# EAGLE design uC_power (EAGLE 9.6.2)
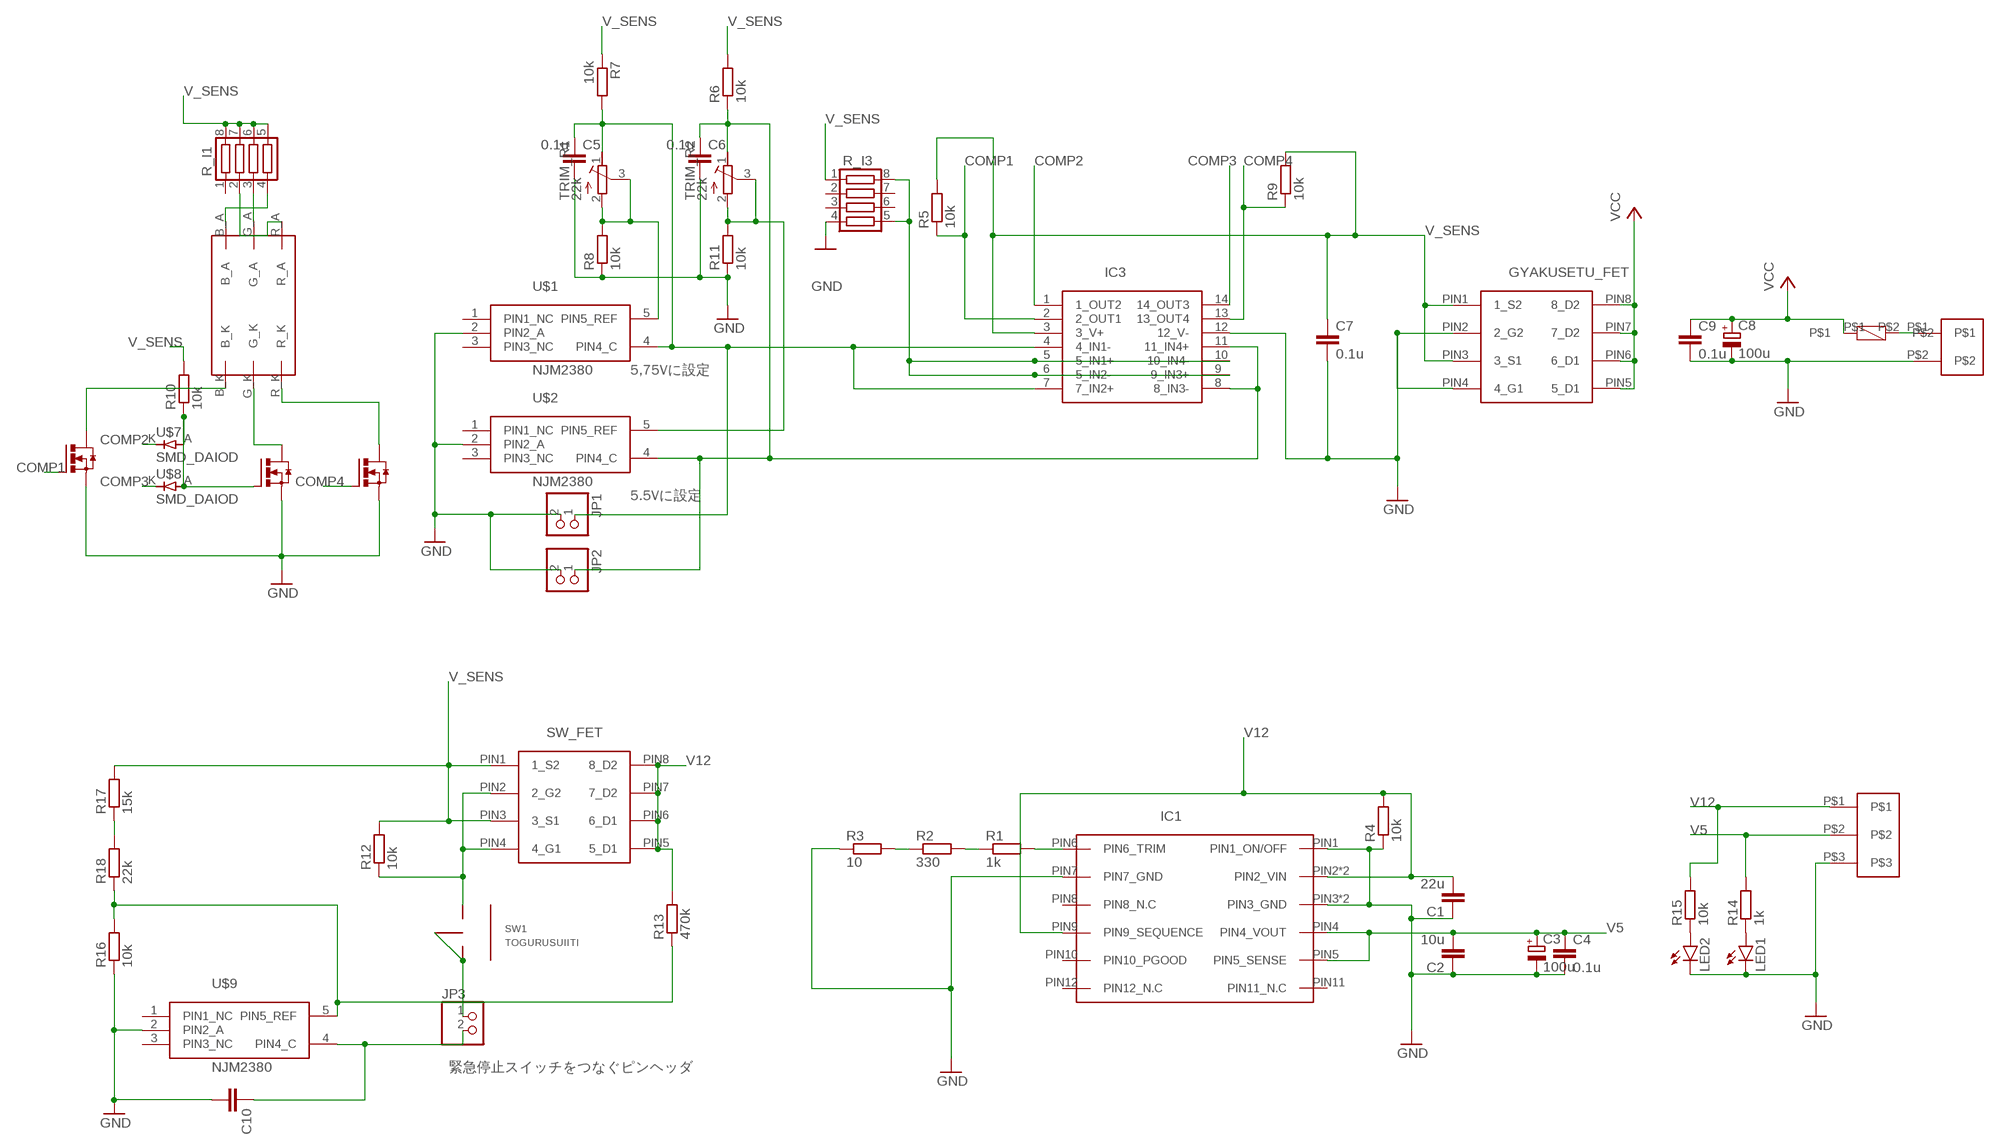
[diagram p0: schematic, sheet 1]

## Parts
C1  22u  C-EUC1608  [C1608]
C2  10u  C-EUC1608  [C1608]
C3  100u  CPOL-EU153CLV-0605  [153CLV-0605]
C4  0.1u  C-EUC1608  [C1608]
C5  0.1u  C-EUC1608  [C1608]
C6  0.1u  C-EUC1608  [C1608]
C7  0.1u  C-EUC1608  [C1608]
C8  100u  CPOL-EU153CLV-0605  [153CLV-0605]
C9  0.1u  C-EUC1608  [C1608]
C10  C-EUC1608  [C1608]
F1  RGEF300  [RGEF300]
GYAKUSETU_FET  FDS4935A  [SOP8]
IC1  MURATA_OKL-T/6-W12N-C  [OKL-T/6-W12N-C]
IC3  UPC339GR  [TSSOP14]
JP1  PINHD-1X2  [1X02]
JP2  PINHD-1X2  [1X02]
JP3  PINHD-1X2  [1X02]
LED1  1608LED  [1608]
LED2  1608LED  [1608]
R1  1k  R_REG  [1608]
R2  330  R_REG  [1608]
R3  10  R_REG  [1608]
R4  10k  R_REG  [1608]
R5  10k  R_REG  [1608]
R6  10k  R_REG  [1608]
R7  10k  R_REG  [1608]
R8  10k  R_REG  [1608]
R9  10k  R_REG  [1608]
R10  10k  R_REG  [1608]
R11  10k  R_REG  [1608]
R12  10k  R_REG  [1608]
R13  470k  R_REG  [1608]
R14  1k  R_REG  [1608]
R15  10k  R_REG  [1608]
R16  10k  R_REG  [1608]
R17  15k  R_REG  [1608]
R18  22k  R_REG  [1608]
R_I1  R_SHUGOU2  [1005X4RESISTOR]
R_I3  R_SHUGOU2  [1005X4RESISTOR]
SW1  TOGURUSUIITI  [TOGURUSUIITI]
SW_FET  FDS4935A  [SOP8]
TRIM_R1  22k  R_TRIM2  [PV23A]
TRIM_R2  22k  R_TRIM2  [PV23A]
U$1  NJM2380  [SOT23-5]
U$2  NJM2380  [SOT23-5]
U$3  SOT23_NFET  [SOT23]
U$4  SOT23_NFET  [SOT23]
U$5  SOT23_NFET  [SOT23]
U$6  RGB_LED  [RGB_LED]
U$7  SMD_DAIOD  [SOD_123]
U$8  SMD_DAIOD  [SOD_123]
U$9  NJM2380  [SOT23-5]
U$10  YUROBLOCK3  [YUROBLOCK3]
U$11  YUROBLOCK2  [YUROBLOCK2]

## Nets
COMP1: IC3.2(2_OUT1) R5.1 U$5.PIN1(PIN1_G)
COMP2: IC3.1(1_OUT2) U$7.K(C)
COMP3: IC3.14(14_OUT3) U$8.K(C)
COMP4: IC3.13(13_OUT4) R9.1 U$3.PIN1(PIN1_G)
G_SW: R10.1 U$4.PIN1(PIN1_G) U$7.A U$8.A
GND: C1.1 C2.1 C3.- C4.2 C5.2 C6.2 C7.2 C8.- C9.2 C10.2 GYAKUSETU_FET.PIN2(2_G2) GYAKUSETU_FET.PIN4(4_G1) IC1.PIN1(PIN1_ON/OFF) IC1.PIN3(PIN3_GND) IC1.PIN3@2(PIN3_GND) IC1.PIN7(PIN7_GND) IC3.12(12_V-) JP1.2 JP2.2 LED1.K LED2.K R3.1 R4.1 R8.1 R11.1 R16.1 R_I3.4 U$1.2(PIN2_A) U$2.2(PIN2_A) U$3.PIN2(PIN3_S) U$4.PIN2(PIN3_S) U$5.PIN2(PIN3_S) U$9.2(PIN2_A) U$10.P$3 U$11.P$2
N$1: R2.1 R3.2
N$2: R1.1 R2.2
N$3: IC1.PIN6(PIN6_TRIM) R1.2
N$4: R12.1 SW1.1 SW_FET.PIN2(2_G2) SW_FET.PIN4(4_G1)
N$5: C5.1 IC3.4(4_IN1-) IC3.7(7_IN2+) JP1.1 R7.2 TRIM_R1.1(E) U$1.4(PIN4_C)
N$6: C10.1 JP3.2 U$9.4(PIN4_C)
N$7: LED1.A R14.1
N$8: R13.1 R16.2 R18.1 U$9.5(PIN5_REF)
N$9: U$3.PIN3(PIN2_D) U$6.R_K
N$10: U$4.PIN3(PIN2_D) U$6.G_K
N$11: U$5.PIN3(PIN2_D) U$6.B_K
N$12: R_I1.4 U$6.B_A
N$13: R_I1.3 U$6.G_A
N$14: R_I1.2 U$6.R_A
N$15: R8.2 TRIM_R1.2(A) TRIM_R1.3(S) U$1.5(PIN5_REF)
N$16: R11.2 TRIM_R2.2(A) TRIM_R2.3(S) U$2.5(PIN5_REF)
N$17: R17.1 R18.2
N$18: LED2.A R15.1
N$19: C6.1 IC3.8(8_IN3-) IC3.11(11_IN4+) JP2.1 R6.1 TRIM_R2.1(E) U$2.4(PIN4_C)
N$20: JP3.1 SW1.2 SW1.C
N$21: F1.P$2 U$11.P$1
N$25: IC3.5(5_IN1+) IC3.6(5_IN2-) IC3.9(9_IN3+) IC3.10(10_IN4-) R_I3.5 R_I3.8
V5: C2.2 C3.+ C4.1 IC1.PIN4(PIN4_VOUT) IC1.PIN5(PIN5_SENSE) R14.2 U$10.P$2
V12: C1.2 IC1.PIN2(PIN2_VIN) IC1.PIN2@2(PIN2_VIN) IC1.PIN9(PIN9_SEQUENCE) R4.2 R13.2 R15.2 SW_FET.PIN5(5_D1) SW_FET.PIN6(6_D1) SW_FET.PIN7(7_D2) SW_FET.PIN8(8_D2) U$10.P$1
V_SENS: C7.1 GYAKUSETU_FET.PIN1(1_S2) GYAKUSETU_FET.PIN3(3_S1) IC3.3(3_V+) R5.2 R6.2 R7.1 R9.2 R10.2 R12.2 R17.2 R_I1.5 R_I1.6 R_I1.7 R_I1.8 R_I3.1 SW_FET.PIN1(1_S2) SW_FET.PIN3(3_S1)
VCC: C8.+ C9.1 F1.P$1 GYAKUSETU_FET.PIN5(5_D1) GYAKUSETU_FET.PIN6(6_D1) GYAKUSETU_FET.PIN7(7_D2) GYAKUSETU_FET.PIN8(8_D2)
Unconnected: IC1.PIN8(PIN8_N.C) IC1.PIN10(PIN10_PGOOD) IC1.PIN11(PIN11_N.C) IC1.PIN12(PIN12_N.C) R_I1.1 R_I3.2 R_I3.3 R_I3.6 R_I3.7 SW1.NC SW1.NC@2(NC) U$1.1(PIN1_NC) U$1.3(PIN3_NC) U$2.1(PIN1_NC) U$2.3(PIN3_NC) U$9.1(PIN1_NC) U$9.3(PIN3_NC)

## Notes on the sheet
- 5,75Vに設定
- 5.5Vに設定
- 緊急停止スイッチをつなぐピンヘッダ

## Library data of the parts
C1 C2 C4-C7 C9 C10 = rcl:C-EU: CAPACITOR, European symbol; SPICEPREFIX: C
C3 C8 = rcl:CPOL-EU: POLARIZED CAPACITOR, European symbol; SPICEPREFIX: C
F1 = user_hyuzu:RGEF300
GYAKUSETU_FET SW_FET = user_tr_fet_igbt:FDS4935A: デュアルPchMOSFET on抵抗19mΩ DS_max電圧-30v GS_max電圧20v 秋月電子通商通販コード[I-01246]
IC1 = user_ic:MURATA_OKL-T/6-W12N-C: ムラタの電源IC 秋月電子通商 M-06187 秋月電子の電源モジュールの中ではカタログスペック最強
IC3 = user_ic:UPC339GR: ルネサスの汎用コンパレータ 単一電源、両電源対応 オープンコレクタ rsコンポーネンツ通販コード[641-6300]
JP1-JP3 = pinhead:PINHD-1X2: PIN HEADER
LED1 LED2 = user_leds:1608LED: 1608LED
R1-R18 = user_rcl:R_REG: 1608パッケージのチップ抵抗 ガッコのリールの抵抗はたぶんこれ
R_I1 R_I3 = user_rcl:R_SHUGOU
SW1 = user_swich:TOGURUSUIITI: 基板用小型3pトグルスイッチ1回路2接点 秋月電子通商通販コード[P-00300]
TRIM_R1 TRIM_R2 = user_rcl:R_TRIM
U$1 U$2 U$9 = user_ic:NJM2380: njm2380af シャントレギュレータ（降伏電圧が可変可能なツナダイオードみたいなもの） ref=2.465(1%) 秋月電子通商[I-14049]
U$3-U$5 = user_tr_fet_igbt:SOT23_NFET
U$6 = user_leds:RGB_LED: 秋月電子通商 I-12726
U$7 U$8 = user_diode:SMD_DAIOD: パッケージはSOD123
U$10 = user_conector:YUROBLOCK3
U$11 = user_conector:YUROBLOCK2: ユーロブロック 秋月電子[P-11599]

## Board
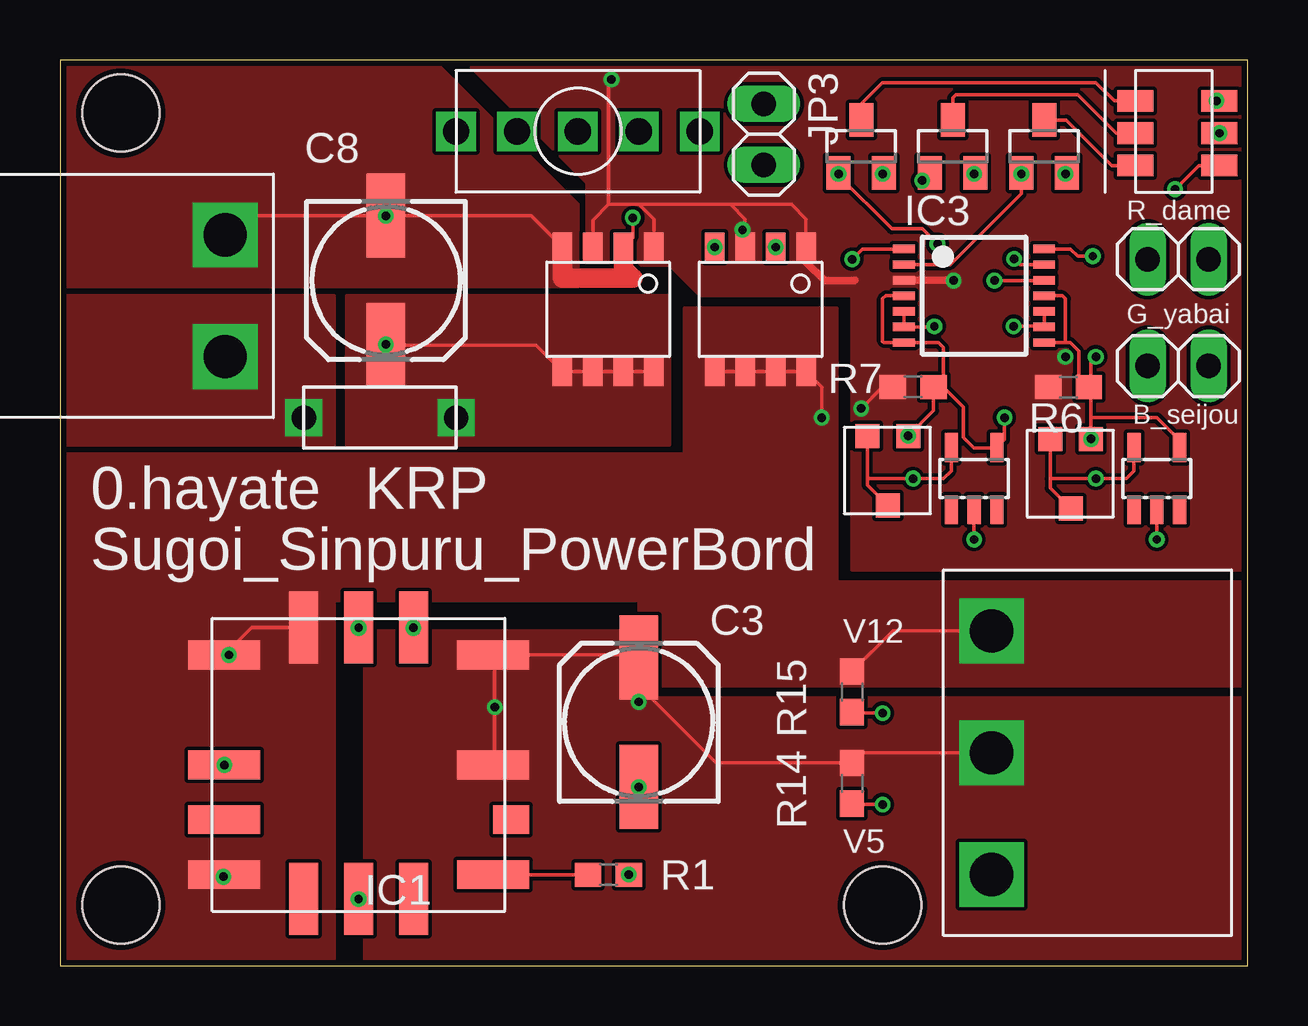
[diagram p1: board, top side]
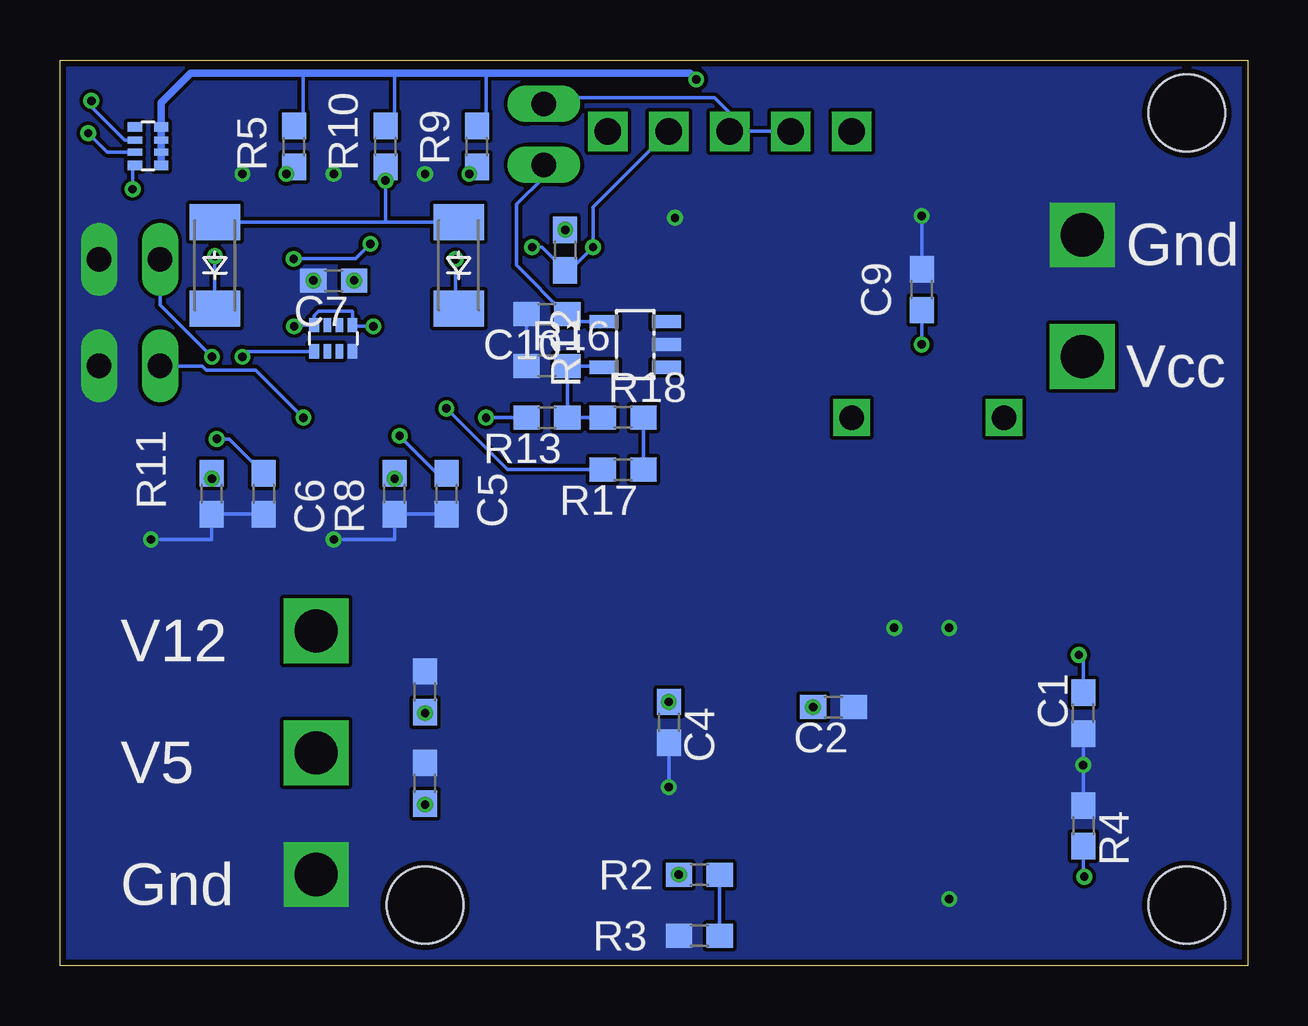
[diagram p2: board, bottom side, seen from below]

Size 49.51 x 37.77 mm. Coordinates in mm from the lower left corner, seen from the top.
Outline: 0,0 49.51,0 49.51,37.77 0,37.77 0,0
Copper layers (1*16): Top 0.035mm / dielectric 1.5mm / Bottom 0.035mm
Design rules "SeeedStudio_2layer_DRU_no_angle_20140221": minimum track width 6mil, minimum drill 12mil, track to track 6mil, track to pad 6mil, pad to pad 6mil, via to via 6mil, smd to smd 0mil, copper to edge 10mil, drill to drill 10mil, minimum pad ring 10mil, minimum via ring 6mil, stop-mask expansion 2mil, vias tented up to drill 100mil, thermal gap 10mil
Holes 3.2 mm at 2.54,2.54 34.29,2.54 2.54,35.56

### Footprints (pad centres in the part's own frame; a part is rotated, then mirrored left to right if it is on the bottom)
C1608 = smd 1.1 x 1: 1 -0.85,0; 2 0.85,0
153CLV-0605 = smd 3.5 x 1.6: + 2.7,0; - -2.7,0
RGEF300 = drill 1.02 square: P$1 0,0; P$2 6.35,0
SOP8 = smd 0.8 x 1.2: PIN1 0.65,-4.57; PIN2 1.92,-4.57; PIN3 3.19,-4.57; PIN4 4.46,-4.57; PIN5 4.46,0.62; PIN6 3.19,0.62; PIN7 1.92,0.62; PIN8 0.65,0.62
OKL-T/6-W12N-C = smd 3 x 1.2: PIN1 -5.85,0.77; PIN2 -5.85,5.35; PIN4 5.35,5.35; PIN5 5.35,0.77; PIN6 5.35,-3.81; PIN9 -5.85,-3.81; PIN10 -5.85,-1.52 | smd 1.2 x 3: PIN2@2 -2.54,6.49; PIN3 -0.25,6.49; PIN3@2 2.04,6.49; PIN7 -0.25,-4.81; PIN8 -2.54,-4.81; PIN12 2.04,-4.81 | smd 1.5 x 1.2: PIN11 6.1,-1.52
TSSOP14 = smd 0.35 x 0.9: 1 -1.95,-2.925; 2 -1.3,-2.925; 3 -0.65,-2.925; 4 0,-2.925; 5 0.65,-2.925; 6 1.3,-2.925; 7 1.95,-2.925; 8 1.95,2.925; 9 1.3,2.925; 10 0.65,2.925; 11 0,2.925; 12 -0.65,2.925; 13 -1.3,2.925; 14 -1.95,2.925
1X02 = drill 1.016 long: 1 -1.27,0; 2 1.27,0
1608 = smd 1.1 x 1: A -0.85,0; K 0.85,0
1608' = smd 1.1 x 1: 1 -0.85,0; 2 0.85,0
1005X4RESISTOR = smd 0.4 x 0.6: 1 0.2,-0.8; 4 1.8,-0.8; 5 1.8,0.3; 8 0.2,0.3 | smd 0.3 x 0.6: 2 0.75,-0.8; 3 1.25,-0.8; 6 1.25,0.3; 7 0.75,0.3
TOGURUSUIITI = drill 1.1 square: 1 0,2.54; 2 0,-2.54; C 0,0; NC 0,5.08; NC@2 0,-5.08
PV23A = smd 1 x 1: 1 0,1.7; 2 2.9,0.85; 3 0,0
SOT23-5 = smd 0.55 x 1.2: 1 -0.95,-1.3; 2 0,-1.3; 3 0.95,-1.3; 4 0.95,1.3; 5 -0.95,1.3
SOT23 = smd 1 x 1.4: PIN1 -0.95,-1.1; PIN2 0.95,-1.1; PIN3 0,1.1
RGB_LED = smd 1.5 x 0.9: B_A 3.5,-2.7; B_K 0,-2.7; G_A 3.5,-1.35; G_K 0,-1.35; R_A 3.5,0; R_K 0,0
SOD_123 = smd 1.5 x 2.1: A 1.8,0; K -1.8,0
YUROBLOCK3 = drill 1.8 square: P$1 2,12.7; P$2 2,7.62; P$3 2,2.54
YUROBLOCK2 = drill 1.8 square: P$1 2,7.62; P$2 2,2.54

### Placement (x,y rotation side)
C1  6.86,10.54 90 bottom
C2  17.27,10.79 180 bottom
C3  24.13,10.16 90 top
C4  24.13,10.16 270 bottom
C5  33.4,19.68 270 bottom
C6  41.02,19.68 270 bottom
C7  38.1,28.57 180 bottom
C8  13.59,28.57 270 top
C9  13.59,28.19 90 bottom
C10  29.21,27.18 180 bottom
F1  16.51,22.86 180 top
GYAKUSETU_FET  25.4,25.4 180 top
IC1  12.7,7.62 0 top
IC3  38.1,27.94 270 top
JP1  46.61,25.02 0 top
JP2  46.61,29.46 0 top
JP3  29.34,34.67 270 top
LED1  34.29,7.62 90 bottom
LED2  34.29,11.43 90 bottom
R1  1k  [1608']  22.86,3.81 180 top
R2  330  [1608']  22.86,3.81 180 bottom
R3  10  [1608']  22.86,1.27 0 bottom
R4  10k  [1608']  6.86,5.84 270 bottom
R5  10k  [1608']  39.75,34.16 90 bottom
R6  10k  [1608']  42.04,24.13 180 top
R7  10k  [1608']  35.56,24.13 0 top
R8  10k  [1608']  35.56,19.68 90 bottom
R9  10k  [1608']  32.13,34.16 90 bottom
R10  10k  [1608']  35.94,34.16 90 bottom
R11  10k  [1608']  43.18,19.68 90 bottom
R12  10k  [1608']  28.45,29.84 90 bottom
R13  470k  [1608']  29.21,22.86 180 bottom
R14  1k  [1608']  33.02,7.62 90 top
R15  10k  [1608']  33.02,11.43 90 top
R16  10k  [1608']  29.21,25.02 0 bottom
R17  15k  [1608']  26.04,20.7 180 bottom
R18  22k  [1608']  26.04,22.86 0 bottom
R_I1  45.59,35.18 270 bottom
R_I3  39.12,26.42 0 bottom
SW1  21.59,34.8 270 top
SW_FET  31.75,25.4 180 top
TRIM_R1  33.66,22.1 270 top
TRIM_R2  41.27,21.97 270 top
U$1  38.1,20.32 0 top
U$2  45.72,20.32 0 top
U$3  33.4,34.16 0 top
U$4  37.21,34.16 0 top
U$5  41.02,34.16 0 top
U$6  44.83,36.07 0 top
U$7  32.89,29.21 90 bottom
U$8  43.05,29.21 90 bottom
U$9  25.53,25.91 90 bottom
U$10  36.83,1.27 0 top
U$11  8.89,33.02 180 top

### Tracks (layer width: path | path; a pad name or v marks a point on that pad's centre or on a via)
COMP1  (via drill 0.35)
  Top 0.152: IC3.2 37.11,29.24 40.07,32.2 v40.07,33.02 U$5.PIN1
  Bottom 0.152: R5.1 40.04,33.02 v40.07,33.02
COMP2  (via drill 0.35)
  Top 0.152: IC3.1 33.45,29.89 v33.02,29.46
  Bottom 0.152: v33.02,29.46 33.02,27.54 U$7.K
COMP3  (via drill 0.35)
  Top 0.152: IC3.14 42.12,29.89 42.42,29.59 v43.05,29.59
  Bottom 0.152: v43.05,29.59 U$8.K
COMP4  (via drill 0.35)
  Top 0.152: IC3.13 40.01,29.24 v39.77,29.48 | v36.58,30.1 35.94,30.73 34.67,30.73 32.45,32.95 v32.45,33.02 U$3.PIN1
  Bottom 0.152: v39.77,29.48 37.19,29.48 v36.58,30.1 | R9.1 32.42,33.02 v32.45,33.02
G_SW  (via drill 0.35)
  Top 0.152: U$4.PIN1 v35.94,32.74
  Bottom 0.152: U$8.A U$7.A 35.94,31.01 v35.94,32.74 R10.1
GND  (via drill 0.35)
  Top 0.152: U$11.P$2 7.68,31.27 C8.- 19.64,31.27 GYAKUSETU_FET.PIN4 20.94,29.48 | C7.2 41.01,28.57 IC3.12 | v45.72,17.78 U$2.2 | v38.1,17.78 U$1.2 | v23.88,31.19 23.88,30.37 GYAKUSETU_FET.PIN2 | IC1.PIN1 v6.86,8.38 | U$5.PIN2 41.93,33.02 v41.91,33.02 | U$4.PIN2 38.12,33.02 v38.1,33.02 | U$3.PIN2 34.31,33.02 v34.29,33.02 | IC1.PIN3@2 v14.73,14.1 | IC1.PIN3 v12.45,14.1 | IC1.PIN7 v12.45,2.79
  Top 0.813: GYAKUSETU_FET.PIN4 20.94,28.67 23.88,28.67 23.48,29.07 GYAKUSETU_FET.PIN2
  Bottom 0.152: C8.- C9.2 | C6.2 R11.1 43.18,17.78 v45.72,17.78 | C5.2 R8.1 35.56,17.78 v38.1,17.78 | R4.1 v6.86,8.38 C1.1 | C3.- C4.2 | R16.1 C10.2
  other vias: 13.59,31.27 38.95,28.57 24.13,7.46
  pour Top (no thermals): 0,28.32 0,38.1 15.24,38.1 21.59,31.75 21.59,28.32
  pour Bottom (no thermals): 0,38.1 0,0 49.53,0 49.53,38.1
N$1
  Bottom 0.152: R2.1 R3.2
N$2  (via drill 0.35)
  other vias: 23.71,3.81
N$3
  Top 0.152: IC1.PIN6 R1.2
N$4  (via drill 0.35)
  Bottom 0.152: SW_FET.PIN2 29.42,29.97 R12.1 28.27,29 SW_FET.PIN4 27.29,31.64 SW1.1
  other vias: 27.29,29.97 29.83,29.97
N$5  (via drill 0.35)
  Top 0.152: 36.83,24.13 R7.2 36.41,23.15 v35.35,22.1 | IC3.4 34.42,27.94 34.29,27.81 34.29,26.04 34.34,25.99 IC3.7 36.61,25.99 36.83,25.77 36.83,24.13 | 36.83,24.13 37.65,23.31 37.65,22.04 38.1,21.59 39.02,21.59 U$1.4 39.37,21.94 v39.37,22.86
  Bottom 0.152: C5.1 33.79,20.54 v35.35,22.1 | JP1.1 43.59,25.02 43.41,24.84 41.35,24.84 v39.37,22.86
N$6
  Bottom 0.152: U$9.4 28.04,26.86 C10.1 28.45,27.18 30.48,29.21 30.48,31.75 29.34,32.89 JP3.2
N$7  (via drill 0.35)
  Top 0.152: R14.1 33.06,6.73 v34.29,6.73
  Bottom 0.152: LED1.A v34.29,6.73
N$8
  Bottom 0.152: U$9.5 26.89,25.02 R16.2 R13.1 R18.1
N$9
  Top 0.152: U$6.R_K 43.94,36.07 43.18,36.83 34.29,36.83 33.4,35.94 U$3.PIN3
N$10
  Top 0.152: U$4.PIN3 37.21,36.2 37.34,36.32 42.42,36.32 44.02,34.72 U$6.G_K
N$11
  Top 0.152: U$5.PIN3 41.95,35.26 43.85,33.37 U$6.B_K
N$12  (via drill 0.35)
  Top 0.152: U$6.B_A 47.47,33.37 v46.48,32.38
  Bottom 0.152: v46.48,32.38 46.48,33.29 R_I1.4
N$13  (via drill 0.35)
  Bottom 0.152: U$6.G_A 47.54,33.93 R_I1.3
  other vias: 48.33,34.72
N$14  (via drill 0.35)
  Top 0.152: U$6.R_A v48.2,36.07
  Bottom 0.152: v48.2,36.07 48.33,35.94 46.82,34.43 R_I1.2
N$15  (via drill 0.35)
  Top 0.152: TRIM_R1.2 33.66,20.05 33.66,20.32 | 33.66,20.32 TRIM_R1.3 | 33.66,20.32 v35.56,20.32 36.83,20.32 37.15,20.64 U$1.5
  Bottom 0.152: R8.2 v35.56,20.32
N$16  (via drill 0.35)
  Top 0.152: TRIM_R2.3 41.27,20.32 | 41.27,20.32 41.27,19.92 TRIM_R2.2 | 41.27,20.32 v43.18,20.32 44.45,20.32 44.77,20.64 U$2.5
  Bottom 0.152: R11.2 v43.18,20.32
N$17
  Bottom 0.152: R18.2 R17.1
N$18  (via drill 0.35)
  Top 0.152: R15.1 33.06,10.54 v34.29,10.54
  Bottom 0.152: LED2.A v34.29,10.54
N$19  (via drill 0.35)
  Top 0.152: TRIM_R2.1 42.98,22.86 | 42.98,22.86 42.98,24.04 | 42.98,24.04 R6.1 42.47,24.55 42.47,25.63 42.11,25.99 41.91,25.99 | 42.98,22.86 45.72,22.86 46.67,21.91 U$2.4 | 41.91,25.99 IC3.8 | 41.91,25.99 41.91,27.81 41.78,27.94 IC3.11 | v43.18,25.4 42.98,25.2 42.98,24.04
  Bottom 0.152: C6.1 42.46,21.97 TRIM_R2.1 | JP2.1 45.34,27.56 v43.18,25.4
  other vias: 42.98,21.97
N$20
  Bottom 0.152: SW1.2 SW1.C 21.59,35.56 22.23,36.2 29.08,36.2 JP3.1
N$21
  pour Top (no thermals): 0,27.94 11.43,27.94 11.43,21.72 0,21.72
N$25  (via drill 0.35)
  Top 0.152: IC3.5 IC3.6 36.42,26.64 v36.45,26.67 | IC3.10 41.02,26.67 | 41.02,26.67 IC3.9 | v39.75,26.67 41.02,26.67
  Bottom 0.152: v36.45,26.67 37.27,26.67 R_I3.5 37.32,27.28 37.34,27.3 38.73,27.3 38.92,27.12 R_I3.8 39.7,26.72 v39.75,26.67
V5  (via drill 0.35)
  Top 0.152: IC1.PIN5 18.12,8.46 C2.2 18.12,12.9 IC1.PIN4 24.02,12.97 C3.+ 24.13,11.43 | U$10.P$2 33.44,8.89 R14.2 27.34,8.47 24.38,11.43 24.13,11.43 | 24.13,11.43 C4.1
  other vias: 24.13,11.01 18.12,10.79
  pour Top (no thermals): 49.53,11.18 49.53,0 12.7,0 12.7,13.97 23.75,13.97 23.75,11.18
V12  (via drill 0.35)
  Top 0.152: SW_FET.PIN5 SW_FET.PIN6 SW_FET.PIN7 SW_FET.PIN8 31.75,24.13 v31.75,22.86 | v7.04,12.97 IC1.PIN2 7.99,14.11 IC1.PIN2@2 | v6.81,3.72 6.85,3.76 IC1.PIN9 | R15.2 34.71,13.97 U$10.P$1
  Bottom 0.152: C1.2 6.86,12.85 v7.04,12.97 | R4.2 IC1.PIN9 v6.81,3.72 | v31.75,22.86 R13.2
  pour Top (no thermals): 26.04,27.43 32.38,27.43 32.38,16 49.53,16 49.53,11.68 24.13,11.68 24.13,15.24 11.43,15.24 11.43,0 0,0 0,21.34 26.04,21.34
V_SENS  (via drill 0.35)
  Top 0.152: 22.86,31.75 22.21,31.1 GYAKUSETU_FET.PIN3 | 22.86,31.75 24.13,31.75 | 24.13,31.75 24.75,31.13 GYAKUSETU_FET.PIN1 | 33.02,28.48 33.13,28.59 | 24.13,31.75 27.94,31.75 | 27.94,31.75 28.56,31.13 SW_FET.PIN3 28.56,30.58 R12.2 | 27.94,31.75 30.48,31.75 31.1,31.13 SW_FET.PIN1 | v22.99,36.96 22.86,36.83 22.86,31.75 | v33.4,23.24 34.29,24.13 R7.1
  Top 0.305: SW_FET.PIN1 31.1,29.35 31.88,28.57 33.12,28.57 33.13,28.59 | IC3.3 37.23,28.59 C7.1
  Bottom 0.152: 31.75,37.21 31.75,35.39 R9.2 | 35.56,37.21 35.56,35.39 R10.2 | 39.37,37.21 39.37,35.39 R5.2 | R_I3.1 41.69,25.62 v41.91,25.4 | R17.2 30.86,20.7 v33.4,23.24
  Bottom 0.305: v22.99,36.96 23.24,37.21 31.75,37.21 35.56,37.21 39.37,37.21 44.07,37.21 45.29,35.99 R_I1.8 R_I1.7 R_I1.6 R_I1.5
  other vias: 28.45,30.7 37.25,28.57
  pour Top (no thermals): 33.02,16.51 49.53,16.51 49.53,38.1 16.51,38.1 21.97,32.64 21.97,29.21 25.4,29.21 26.67,27.94 33.02,27.94
VCC  (via drill 0.35)
  Top 0.152: 13.43,26.04 C8.+ | C8.+ 19.84,25.88 GYAKUSETU_FET.PIN5 GYAKUSETU_FET.PIN6 GYAKUSETU_FET.PIN7 GYAKUSETU_FET.PIN8 | C8.+ v13.59,25.91
  Bottom 0.152: C9.1 v13.59,25.91
  pour Top (no thermals): 11.94,27.94 25.4,27.94 25.4,21.72 11.94,21.72

### Text on the board
tPlace: R_dame | G_yabai | B_seijou | 0.hayate | KRP | Sugoi_Sinpuru_PowerBord | V12 | V5
bPlace: Gnd | Vcc | V12 | V5 | Gnd